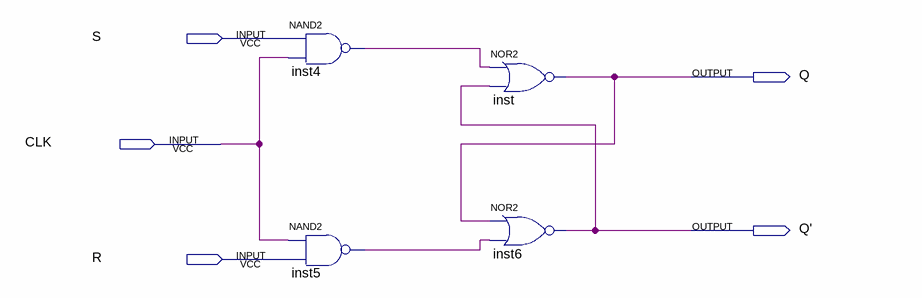
[diagram p0: schematic sheet]
// Quartus schematic SeqDet1101.bdf as structural Verilog: 4 symbols, 5 pins
module SeqDet1101 (
  input  S,
  input  CLK,
  input  R,
  output Q,
  output \Q' 
);

  wire inst4_out, inst5_out;

  nand inst4 (inst4_out, S, CLK);
  nand inst5 (inst5_out, CLK, R);
  nor inst (Q, inst4_out, \Q' );
  nor inst6 (\Q' , Q, inst5_out);
endmodule
